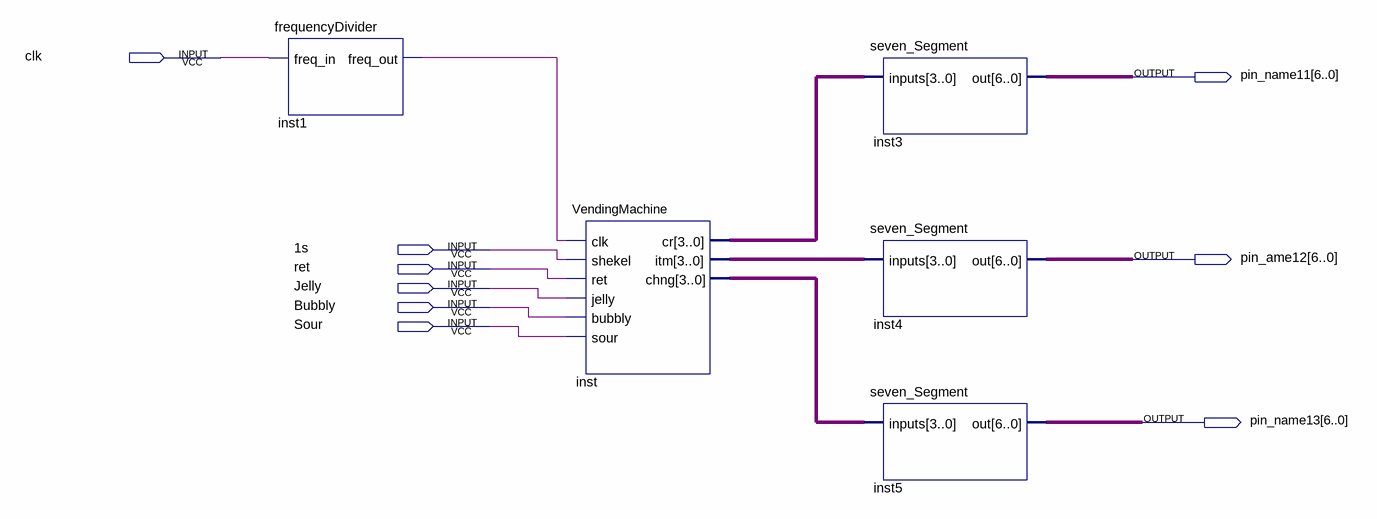
[diagram p0: schematic sheet]
// Quartus schematic LabDigitalProject.bdf as structural Verilog: 5 symbols, 9 pins
module LabDigitalProject (
  input  clk,
  input  \1s ,
  input  ret,
  input  Jelly,
  input  Bubbly,
  input  Sour,
  output [6:0] pin_name11,
  output [6:0] pin_ame12,
  output [6:0] pin_name13
);

  wire inst1_freq_out;
  wire [3:0] inst_chng, inst_cr, inst_itm;

  frequencyDivider inst1 (.freq_in(clk), .freq_out(inst1_freq_out));
  VendingMachine inst (
    .clk(inst1_freq_out), .shekel(\1s ), .ret(ret), .jelly(Jelly), .bubbly(Bubbly), .sour(Sour),
    .cr(inst_cr), .itm(inst_itm), .chng(inst_chng));
  seven_Segment inst3 (.inputs(inst_cr), .out(pin_name11));
  seven_Segment inst4 (.inputs(inst_itm), .out(pin_ame12));
  seven_Segment inst5 (.inputs(inst_chng), .out(pin_name13));
endmodule
